# Altium schematic sheet Subsheets combined.SchDoc: Subsheets Combined
size A4; Organization: Altium Limited; Address1: 3 Minna Close; Address2: Belrose; Address3: NSW 2085; Address4: Australia
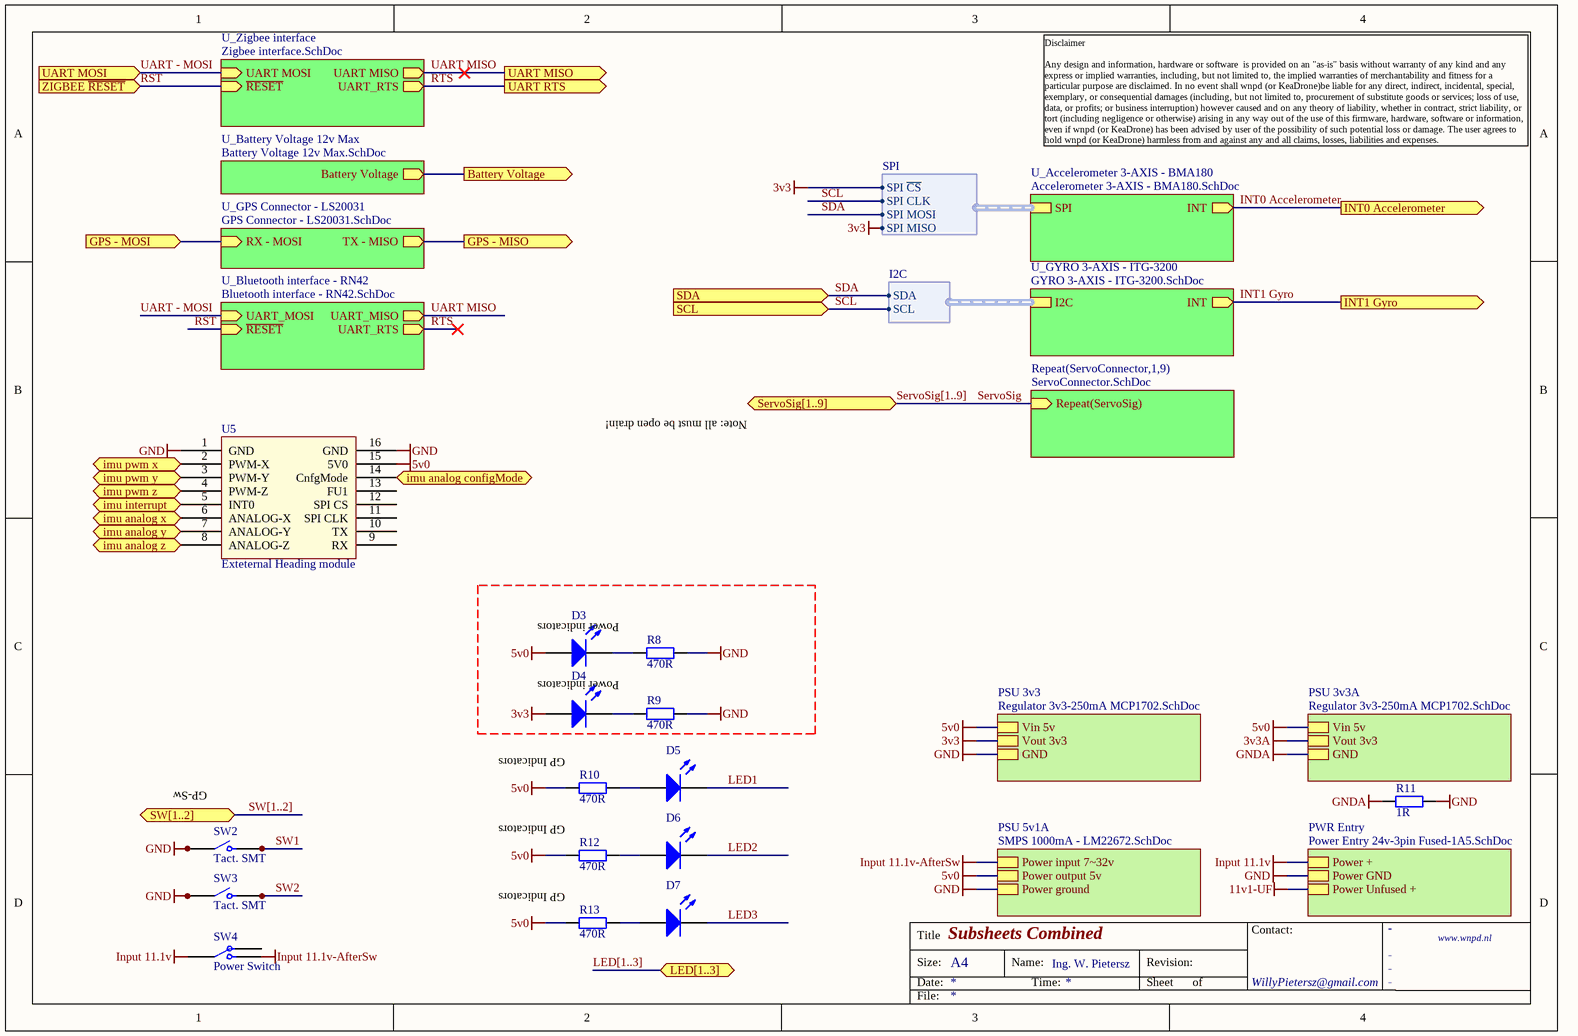
[diagram p0: Subsheets combined.SchDoc]

## Parts
D3  (no value)  [PLCC2]
D4  (no value)  [PLCC2]
D5  (no value)  [PLCC2]
D6  (no value)  [PLCC2]
D7  (no value)  [PLCC2]
R8  value 470R  [R0805]  (hidden comment: RESISTOR)
R9  value 470R  [R0805]  (hidden comment: RESISTOR)
R10  value 470R  [R0805]  (hidden comment: RESISTOR)
R11  value 1R  [R0805]  (hidden comment: RESISTOR)
R12  value 470R  [R0805]  (hidden comment: RESISTOR)
R13  value 470R  [R0805]  (hidden comment: RESISTOR)
SW2  Tact. SMT  [SWITCH TACT]
SW3  Tact. SMT  [SWITCH TACT]
SW4  Power Switch  [1MS1T1B5M1QE]
U5  Exteternal Heading module  [Keadrone_IMUv1]

## Sub-sheets
PSU 3v3 = Regulator 3v3-250mA MCP1702.SchDoc: Vin 5v, Vout 3v3, GND
PSU 3v3A = Regulator 3v3-250mA MCP1702.SchDoc: Vin 5v, Vout 3v3, GND
PSU 5v1A = SMPS 1000mA - LM22672.SchDoc: Power input 7~32v, Power output 5v, Power ground
PWR Entry = Power Entry 24v-3pin Fused-1A5.SchDoc: Power +, Power GND, Power Unfused +
Repeat(ServoConnector,1,9) = ServoConnector.SchDoc: Repeat(ServoSig) (in)
U_Accelerometer 3-AXIS - BMA180 = Accelerometer 3-AXIS - BMA180.SchDoc: INT (out), SPI (harness SPI)
U_Battery Voltage 12v Max = Battery Voltage 12v Max.SchDoc: Battery Voltage (out)
U_Bluetooth interface - RN42 = Bluetooth interface - RN42.SchDoc: UART_MOSI (in), UART_MISO (out), UART_RTS (out), ~{RESET} (in)
U_GPS Connector - LS20031 = GPS Connector - LS20031.SchDoc: RX - MOSI (in), TX - MISO (out)
U_GYRO 3-AXIS - ITG-3200 = GYRO 3-AXIS - ITG-3200.SchDoc: INT (out), I2C (harness I2C)
U_Zigbee interface = Zigbee interface.SchDoc: UART MISO (out), UART MOSI (in), ~{RESET} (in), UART_RTS (out)

## Ports
Battery Voltage (out), GPS - MISO (out), GPS - MOSI (in), imu analog configMode (in), imu analog x (out), imu analog y (out), imu analog z (out), imu interrupt (out), imu pwm x (out), imu pwm y (out), imu pwm z (out), INT0 Accelerometer (out), INT1 Gyro (out), LED[1..3] (bidir), SCL (in), SDA (in), ServoSig[1..9], SW[1..2], UART MISO (out), UART MOSI (in), UART RTS (out), ZIGBEE ~{RESET} (in)

## Harnesses
SPI: SPI ~{CS}, SPI CLK, SPI MOSI, SPI MISO
I2C: SDA, SCL

## Nets
3v3: D4.1(A) ; sheet PSU 3v3/Vout 3v3, sheet U_Accelerometer 3-AXIS - BMA180/SPI.SPI ~{CS}, sheet U_Accelerometer 3-AXIS - BMA180/SPI.SPI MISO
3v3A: sheet PSU 3v3A/Vout 3v3
5v0: D3.1(A) R10.2 R12.2 R13.2 U5.15(5V0) ; sheet PSU 5v1A/Power output 5v, sheet PSU 3v3/Vin 5v, sheet PSU 3v3A/Vin 5v
11v1-UF: sheet PWR Entry/Power Unfused +
GND: R8.1 R9.1 R11.2 SW2.1 SW2.4 SW3.1 SW3.4 U5.1(GND) U5.16(GND) ; sheet PSU 5v1A/Power ground, sheet PSU 3v3/GND, sheet PWR Entry/Power GND
GNDA: R11.1 ; sheet PSU 3v3A/GND
Input 11.1v: SW4.1 ; sheet PWR Entry/Power +
Input 11.1v-AfterSw: SW4.2 ; sheet PSU 5v1A/Power input 7~32v
Battery Voltage: port Battery Voltage, sheet U_Battery Voltage 12v Max/Battery Voltage
GPS - MISO: port GPS - MISO, sheet U_GPS Connector - LS20031/TX - MISO
GPS - MOSI: port GPS - MOSI, sheet U_GPS Connector - LS20031/RX - MOSI
imu analog configMode: U5.14(CnfgMode) ; port imu analog configMode
imu analog x: U5.6(ANALOG-X) ; port imu analog x
imu analog y: U5.7(ANALOG-Y) ; port imu analog y
imu analog z: U5.8(ANALOG-Z) ; port imu analog z
imu interrupt: U5.5(INT0) ; port imu interrupt
imu pwm x: U5.2(PWM-X) ; port imu pwm x
imu pwm y: U5.3(PWM-Y) ; port imu pwm y
imu pwm z: U5.4(PWM-Z) ; port imu pwm z
INT0 Accelerometer: port INT0 Accelerometer, sheet U_Accelerometer 3-AXIS - BMA180/INT
INT1 Gyro: port INT1 Gyro, sheet U_GYRO 3-AXIS - ITG-3200/INT
LED1: D5.2(K)
LED2: D6.2(K)
LED3: D7.2(K)
RST: port ZIGBEE ~{RESET}, sheet U_Zigbee interface/~{RESET}, sheet U_Bluetooth interface - RN42/~{RESET}
RTS: port UART RTS, sheet U_Zigbee interface/UART_RTS, sheet U_Bluetooth interface - RN42/UART_RTS
SCL: port SCL, sheet U_Accelerometer 3-AXIS - BMA180/SPI.SPI CLK, sheet U_GYRO 3-AXIS - ITG-3200/I2C.SCL
SDA: port SDA, sheet U_Accelerometer 3-AXIS - BMA180/SPI.SPI MOSI, sheet U_GYRO 3-AXIS - ITG-3200/I2C.SDA
ServoSig: sheet Repeat(ServoConnector,1,9)/Repeat(ServoSig)
SW1: SW2.2 SW2.3
SW2: SW3.2 SW3.3
UART - MOSI: port UART MOSI, sheet U_Zigbee interface/UART MOSI, sheet U_Bluetooth interface - RN42/UART_MOSI
UART MISO: port UART MISO, sheet U_Zigbee interface/UART MISO, sheet U_Bluetooth interface - RN42/UART_MISO
NetD3_2: D3.2(K) R8.2
NetD4_2: D4.2(K) R9.2
NetD5_1: D5.1(A) R10.1
NetD6_1: D6.1(A) R12.1
NetD7_1: D7.1(A) R13.1

Not connected (* = marked no-connect by the designer): SW4 3; U5 9(RX) 10(TX) 11(SPI_CLK) 12(SPI_CS) 13(FU1)

## Buses and harness runs
bus LED[1..3] = port LED[1..3]
bus ServoSig[1..9] = port ServoSig[1..9]
bus SW[1..2] = port SW[1..2]

## Notes on the sheet
- Note: all must be open drain!
- (near R8) Power indicators
- Power indicators
- (near SW2) GP-Sw
- GP Indicators
- Disclaimer
  Any design and information, hardware or software  is provided on an "as-is" basis without warranty of any kind and any express or implied warranties, including, but not limited to, the implied warranties of merchantability and fitness for a particular purpose are disclaimed. In no event shall wnpd (or KeaDrone)be liable for any direct, indirect, incidental, special, exemplary, or consequential damages (including, but not limited to, procurement of substitute goods or services; loss of use, data, or profits; or business interruption) however caused and on any theory of liability, whether in contract, strict liability, or tort (including negligence or otherwise) arising in any way out of the use of this firmware, hardware, software or information, even if wnpd (or KeaDrone) has been advised by user of the possibility of such potential loss or damage. The user agrees to hold wnpd (or KeaDrone) harmless from and against any and all claims, losses, liabilities and expenses.
- Title
- Size:
- Date:
- A4
- Name:
- Time:
- Ing. W. Pietersz
- Revision:
- Sheet
- of
- WillyPietersz@gmail.com
- Contact:
- -
- www.wnpd.nl
- File:

## Library data of the parts
D3-D7 = Green-PLCC2: LED, Surface Mount LED Indicator; Type: Single_Indicator; Part Number: Green-PLCC2; Author: Willem Pietersz; ROHS: Y; Supplier 2: Farnell; Supplier Part Number 2: 1328317; ComponentLink2Description: Datasheet; ComponentLink2URL: http://cp.literature.agilent.com/litweb/pdf/5988-6546EN.pdf
R8-R10 R12 R13 = 470R: Manufacturer 1: Panasonic; Manufacturer 1 Part No: ERJT06J471V; Power: 0.25W; Tolerance: 0.05; LatestRevision Note: Initial Release; Published: 8-Jun-2000; LatestRevisionDate: 17-Jul-2002; LatestRevisionNote: Re-released for DXP Platform.; PackageReference: AXIAL-0.4; Publisher: Altium Limited; Part Number: 470R; Type: Film; Package: 0805; Component Type: Standard; LatestRevision Date: 30-7-2010; Author: Willy Pietersz; ROHS: Y; Supplier 1: Farnell; Supplier Part Number 1: 1577367; ComponentLink1Description: Manufacturer; ComponentLink2Description: Datasheet
R11 = 1R: Manufacturer 1: Panasonic; Manufacturer 1 Part No: ERJT06J1R0V; Power: 0.25W; Tolerance: 0.05; LatestRevision Note: Initial Release; Published: 8-Jun-2000; LatestRevisionDate: 17-Jul-2002; LatestRevisionNote: Re-released for DXP Platform.; PackageReference: AXIAL-0.4; Publisher: Altium Limited; Part Number: 1R; Type: Film; Package: 0805; Component Type: Standard; LatestRevision Date: 30-7-2010; Author: Willy Pietersz; ROHS: Y; Supplier 2: Farnell; Supplier Part Number 2: 1618236; ComponentLink1Description: Manufacturer; ComponentLink2Description: Datasheet
SW2 SW3 = Pushbutton TACT: Switch; Current: 0.1; Voltage: 42; LatestRevision Note: Initial Release; Part Number: Pushbutton TACT; Component Type: Switch; LatestRevision Date: 4-10-2010; Author: Willem Pietersz; Supplier 1: Farnell; Supplier Part Number 1: 1795335; Number Of Pins: 4
SW4 = Toggle-Sw_1MS1T1B5M1QE: Switch; Current: 2; Voltage: 250; Part Number: Toggle-Sw_1MS1T1B5M1QE; Type: SPDT; Component Type: Switch; Supplier 1: Farnell; Supplier Part Number 1: 9473378; ComponentLink2Description: Datasheet; ComponentLink2URL: http://www.farnell.com/datasheets/650672.pdf; Number Of Pins: 3
U5 = Keadrone-imu-v1: Part Number: Keadrone-imu-v1; Component Type: Gyro, IMU